# Altium schematic sheet Sheet2.SchDoc
size A0
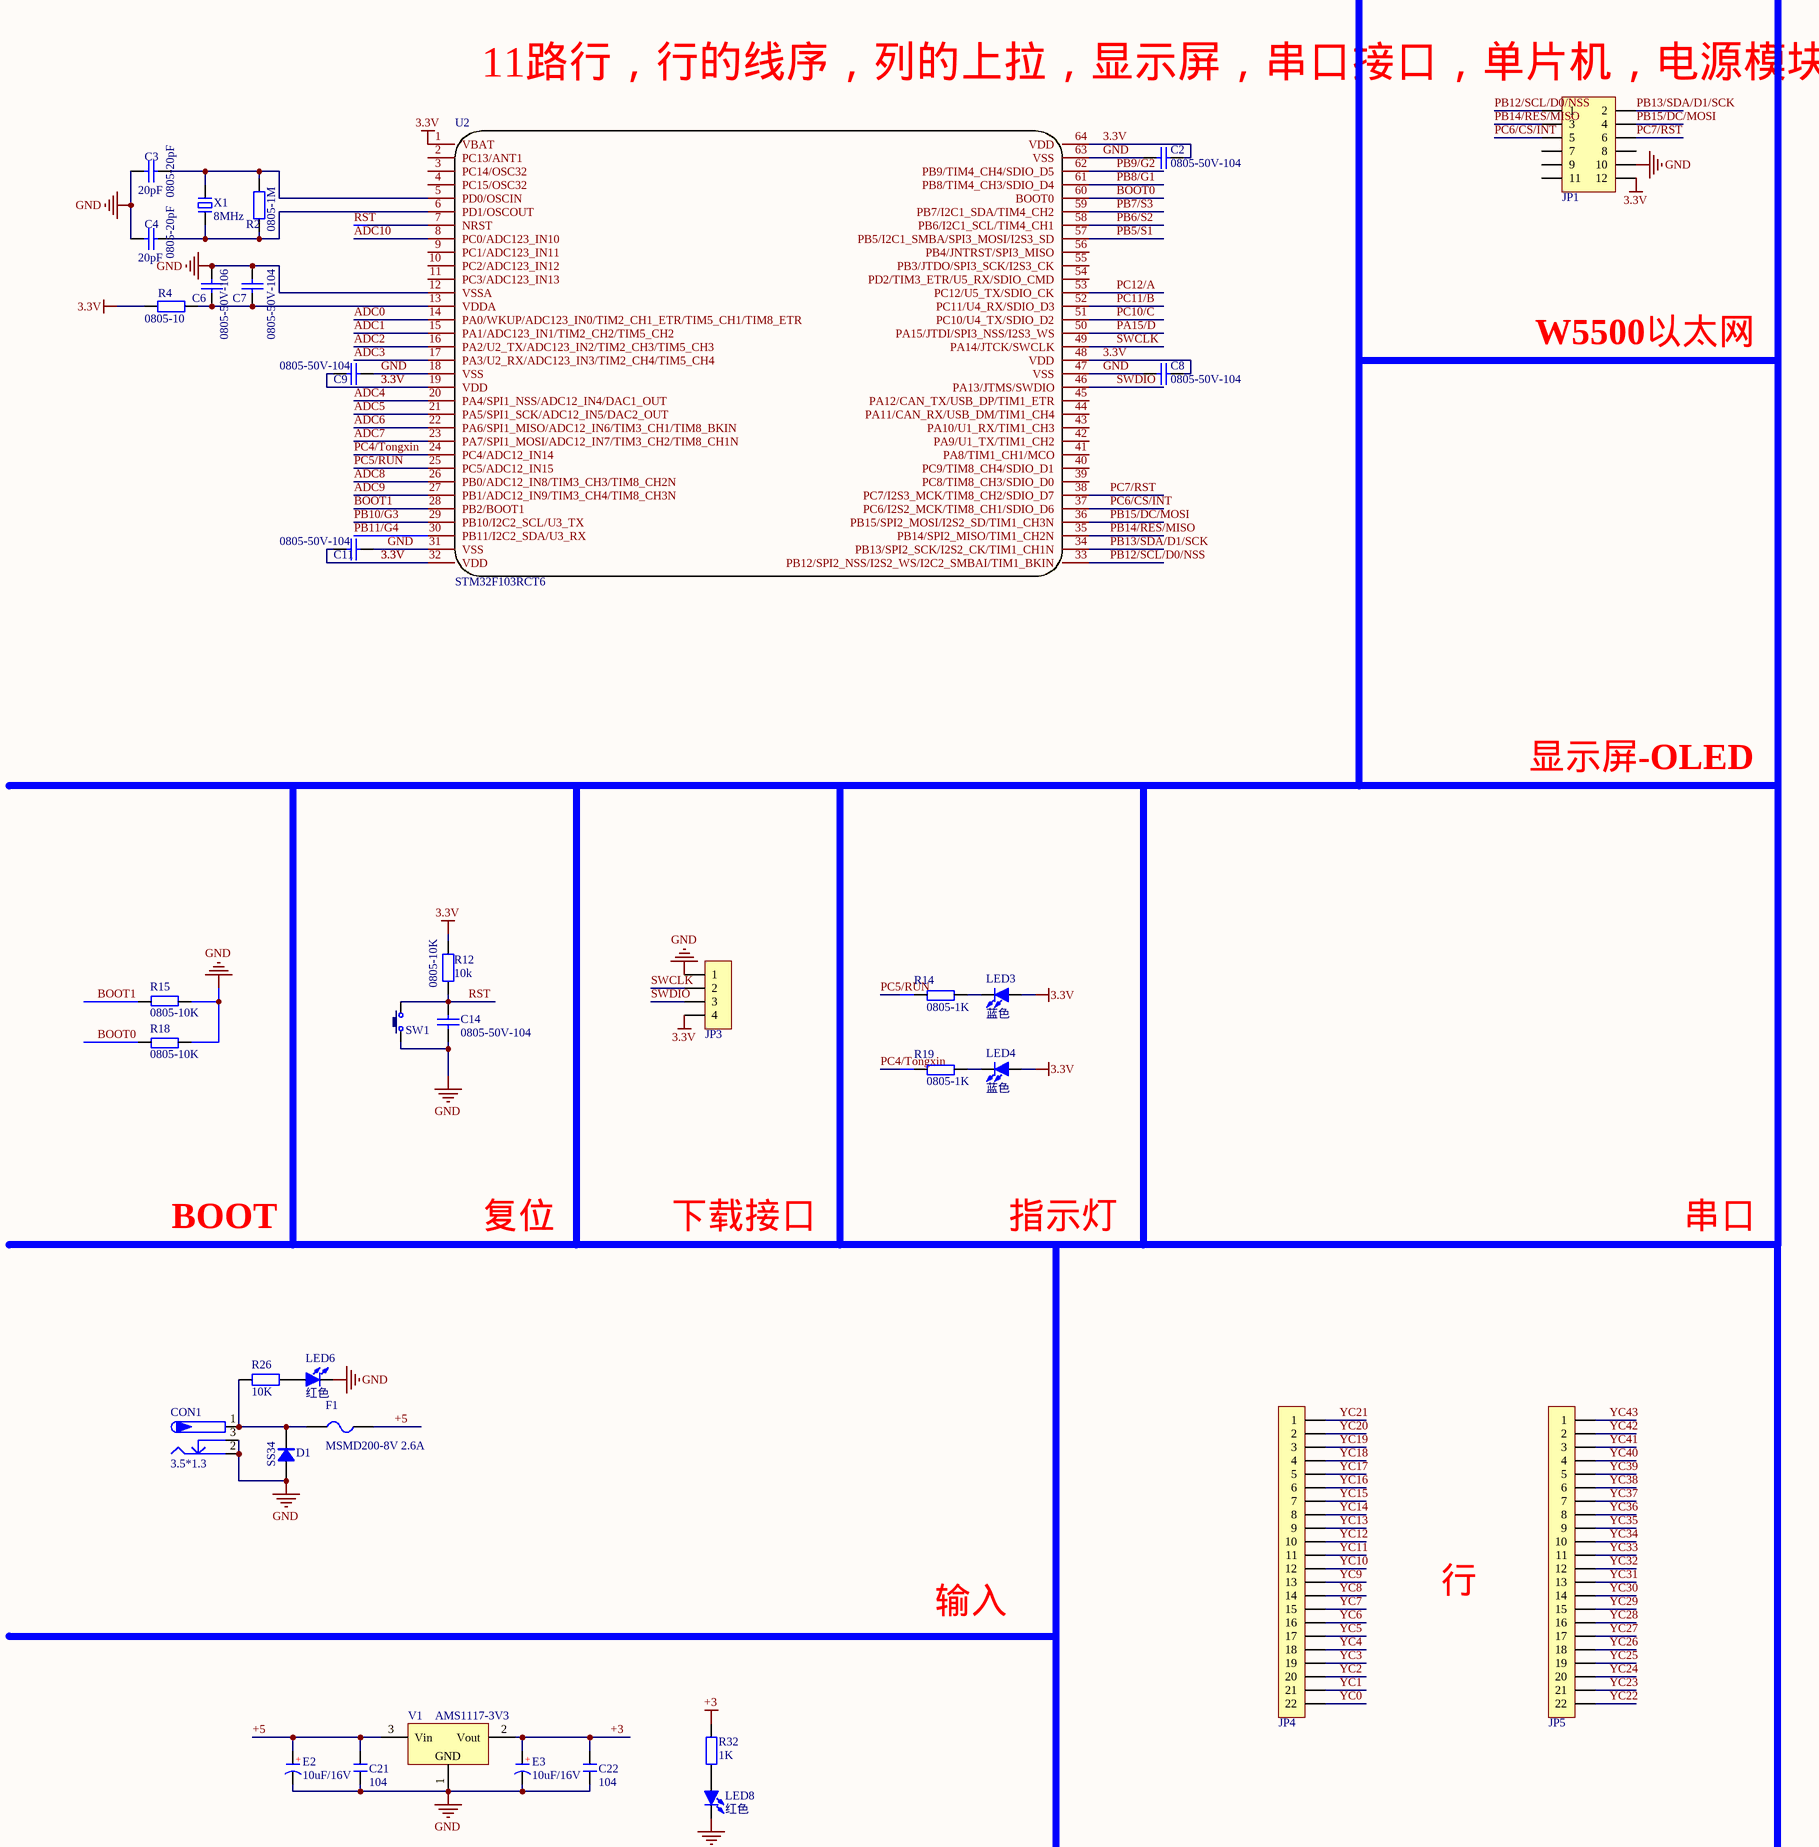
[diagram p0: Sheet2.SchDoc, top left]
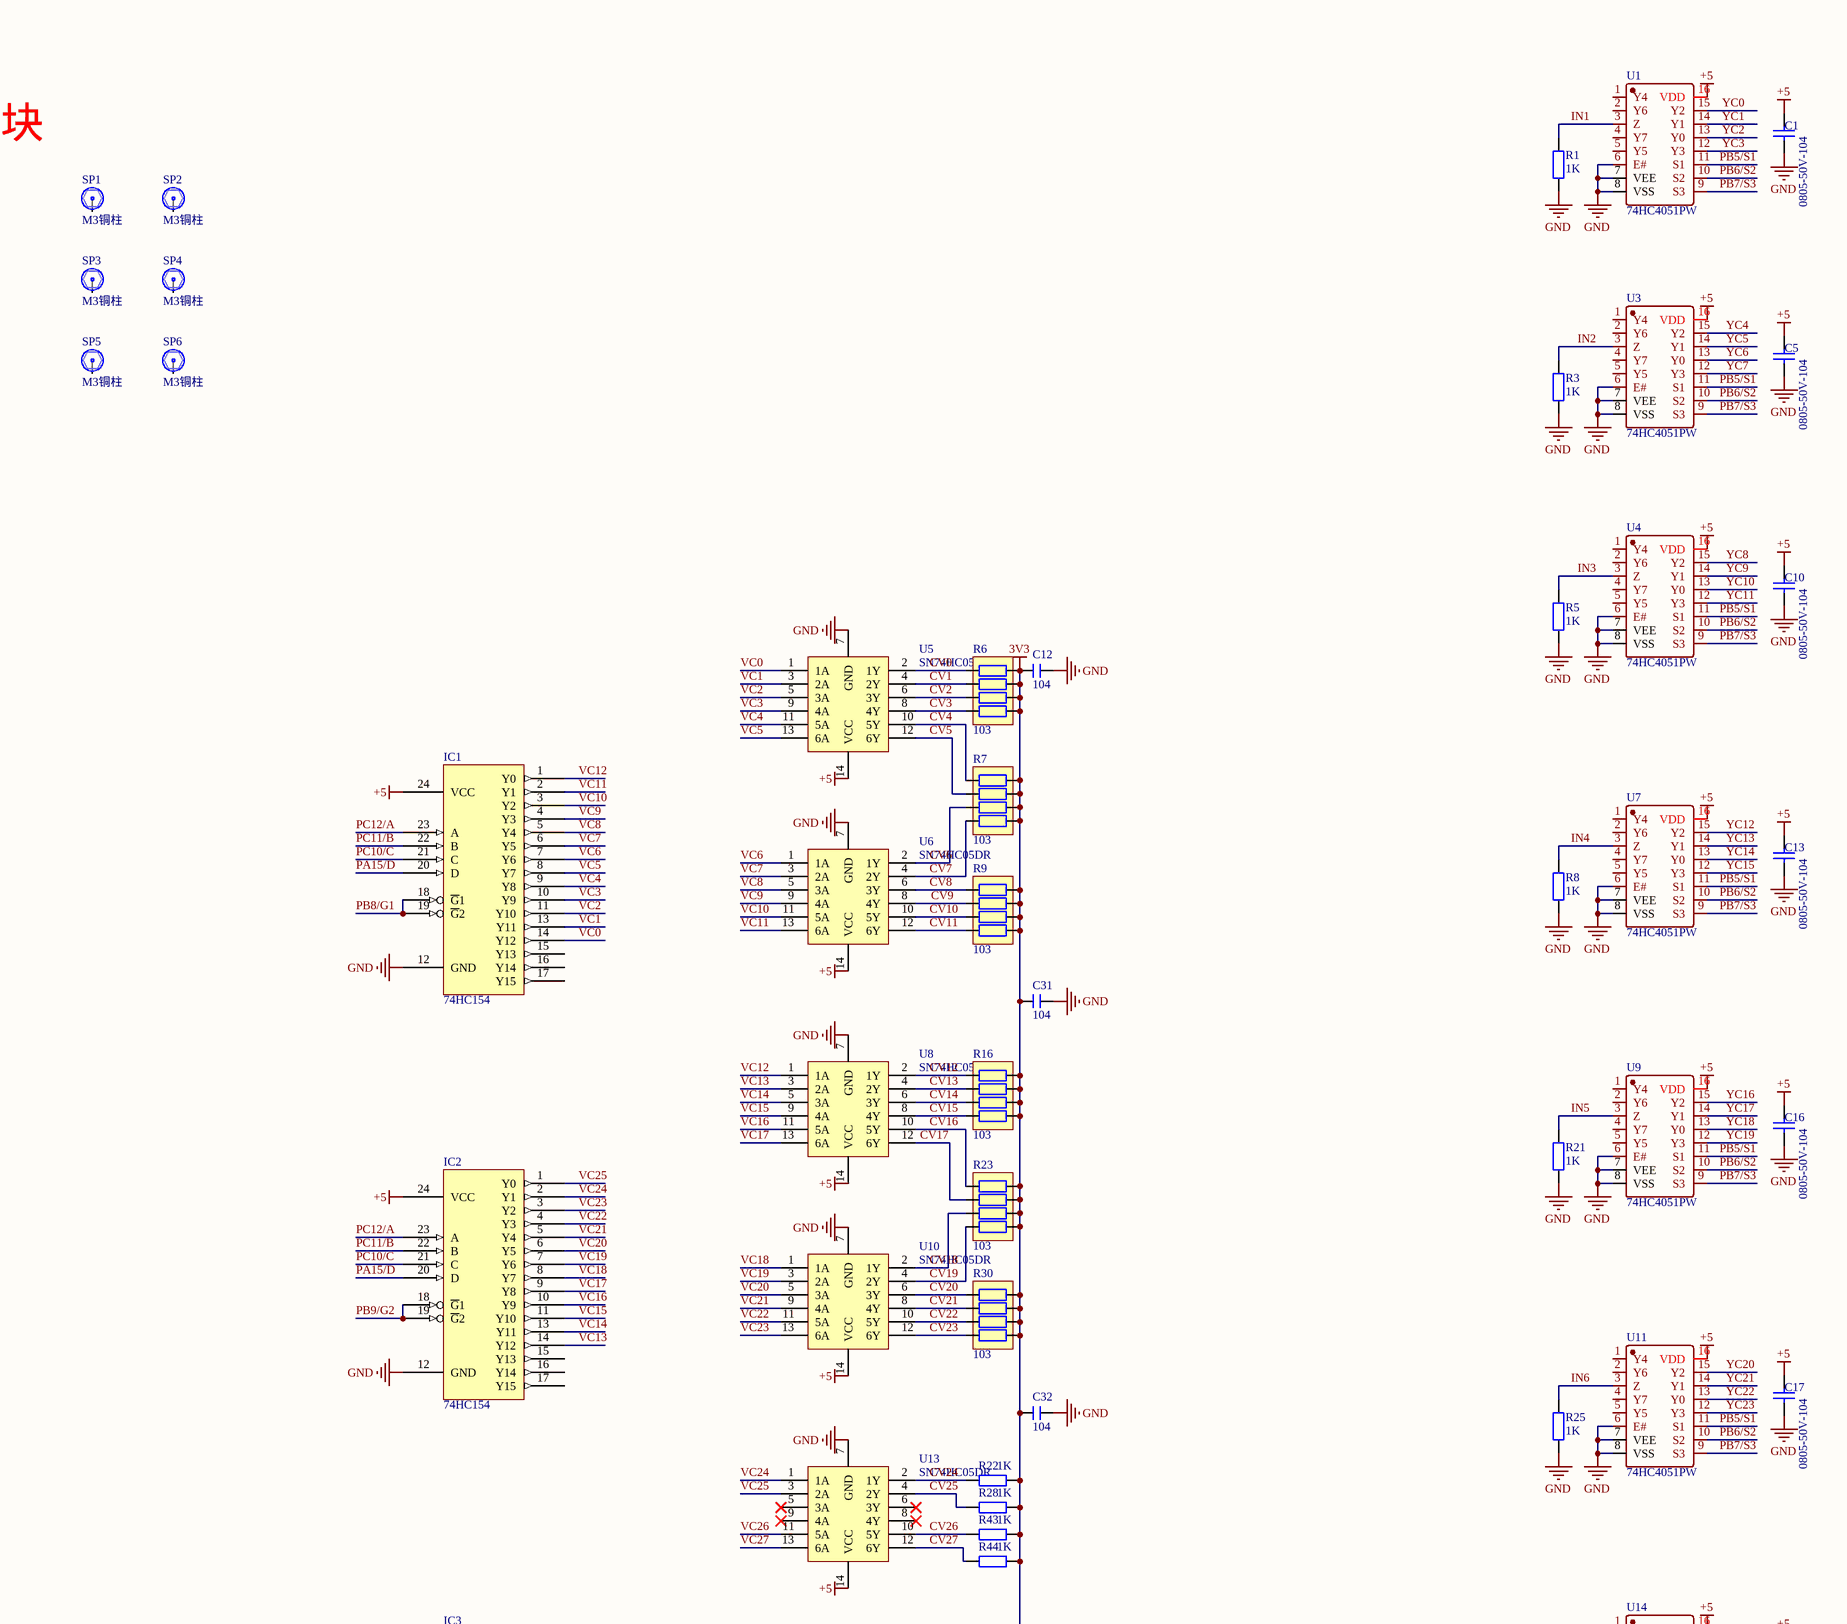
[diagram p1: Sheet2.SchDoc, top right]
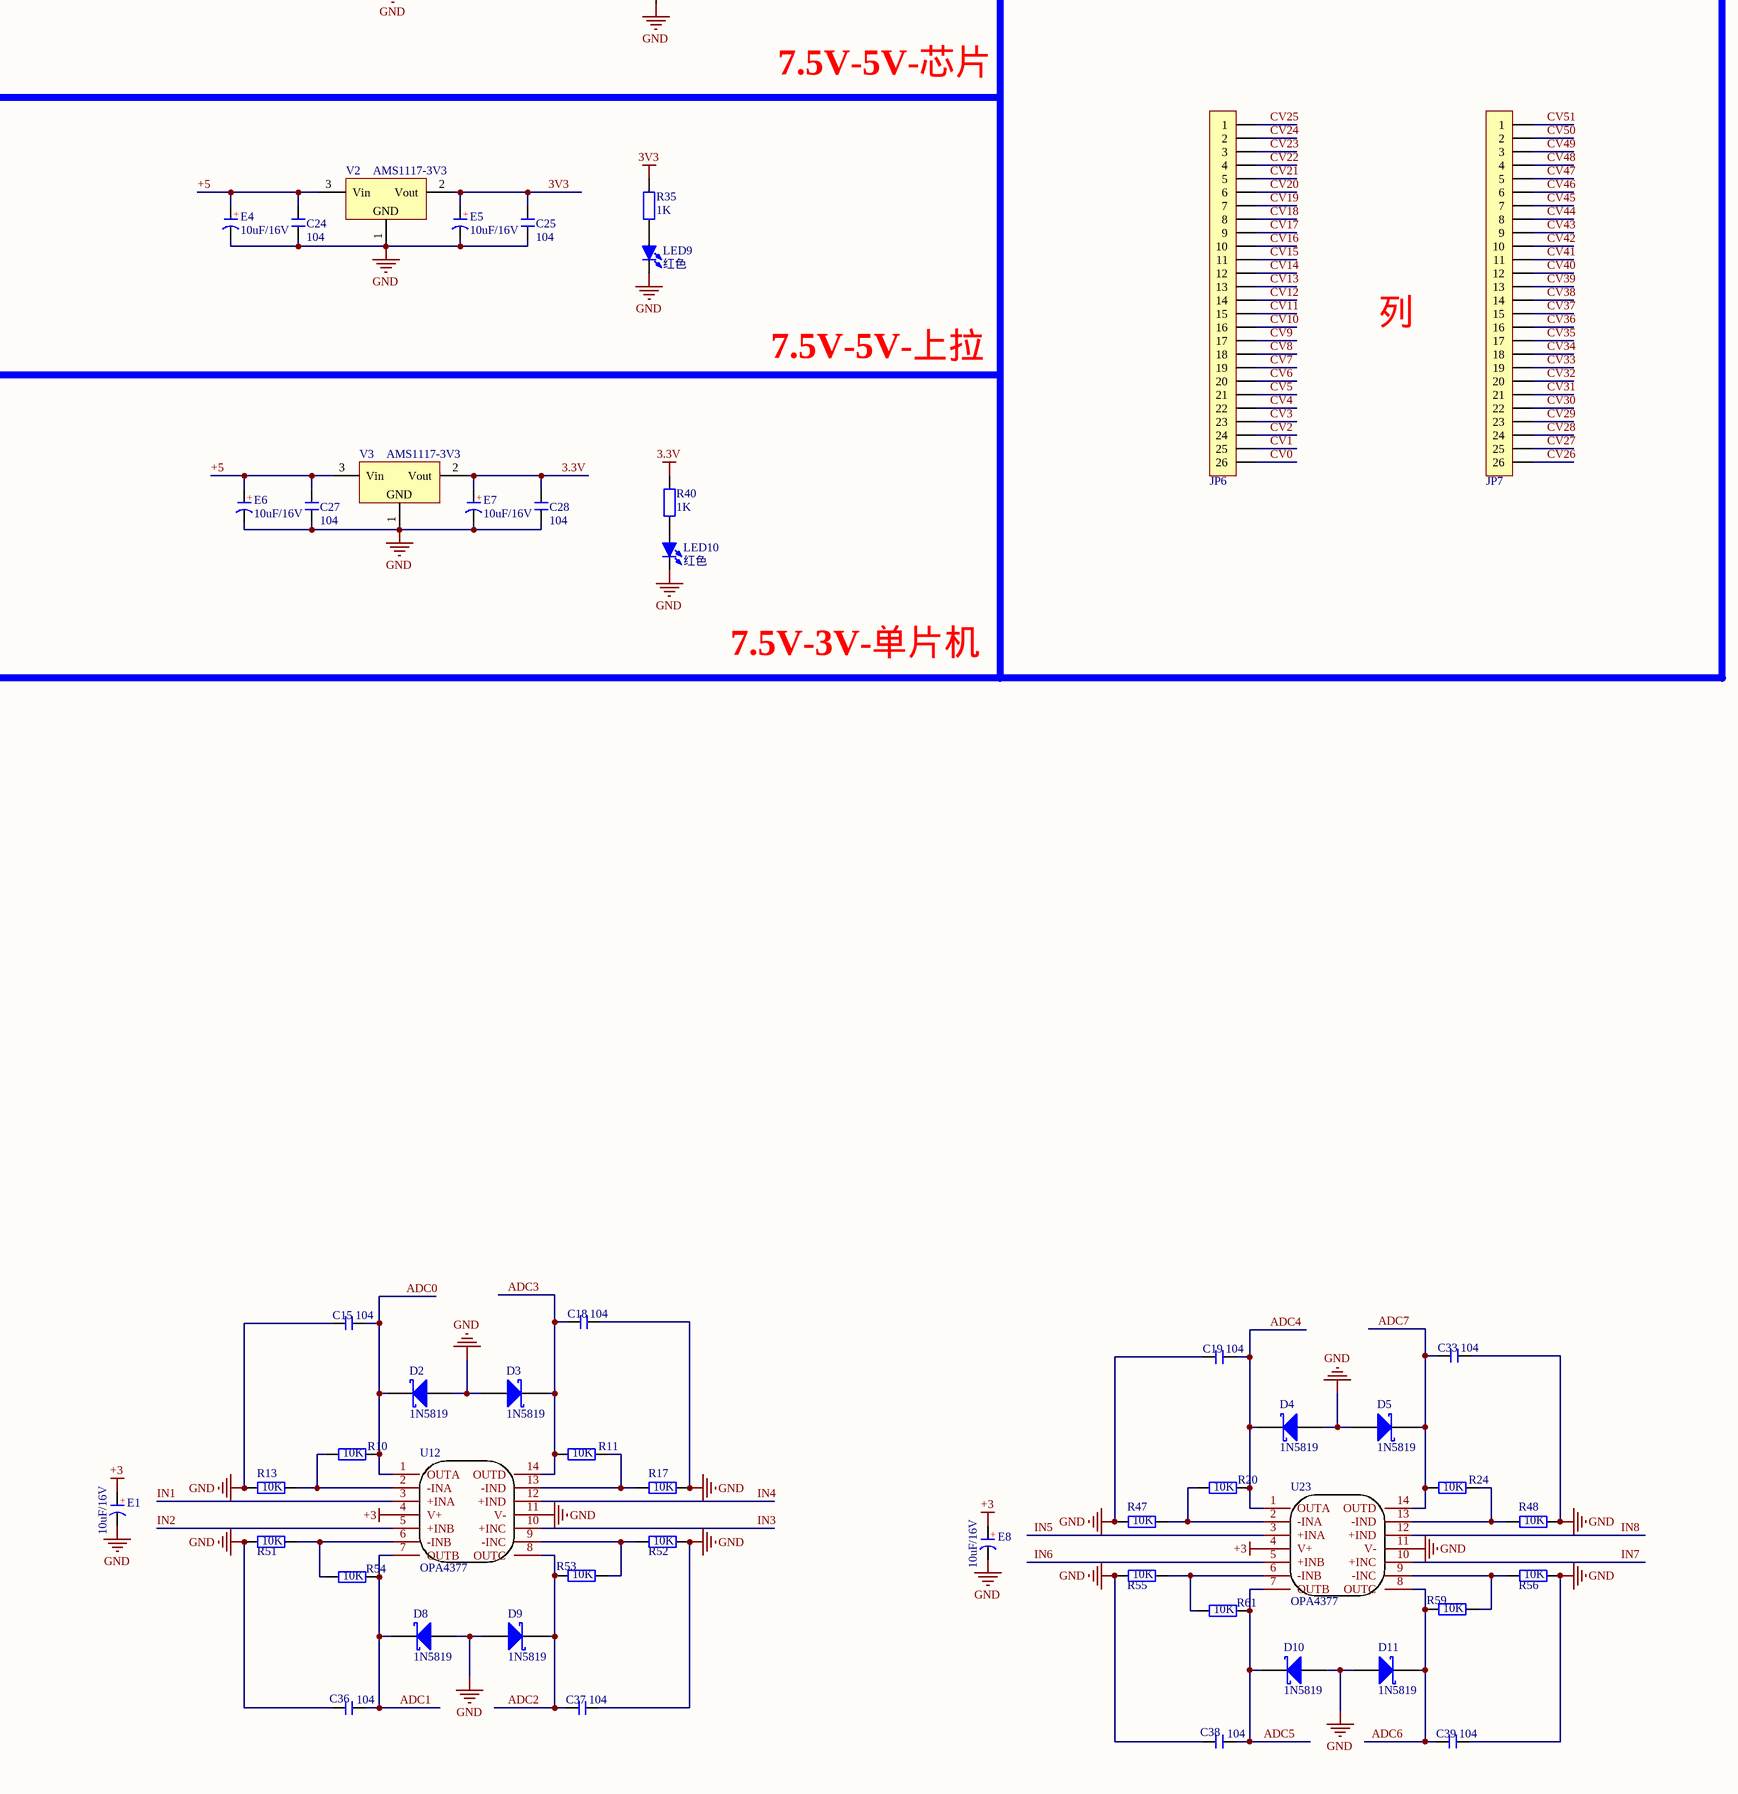
[diagram p2: Sheet2.SchDoc, bottom left]
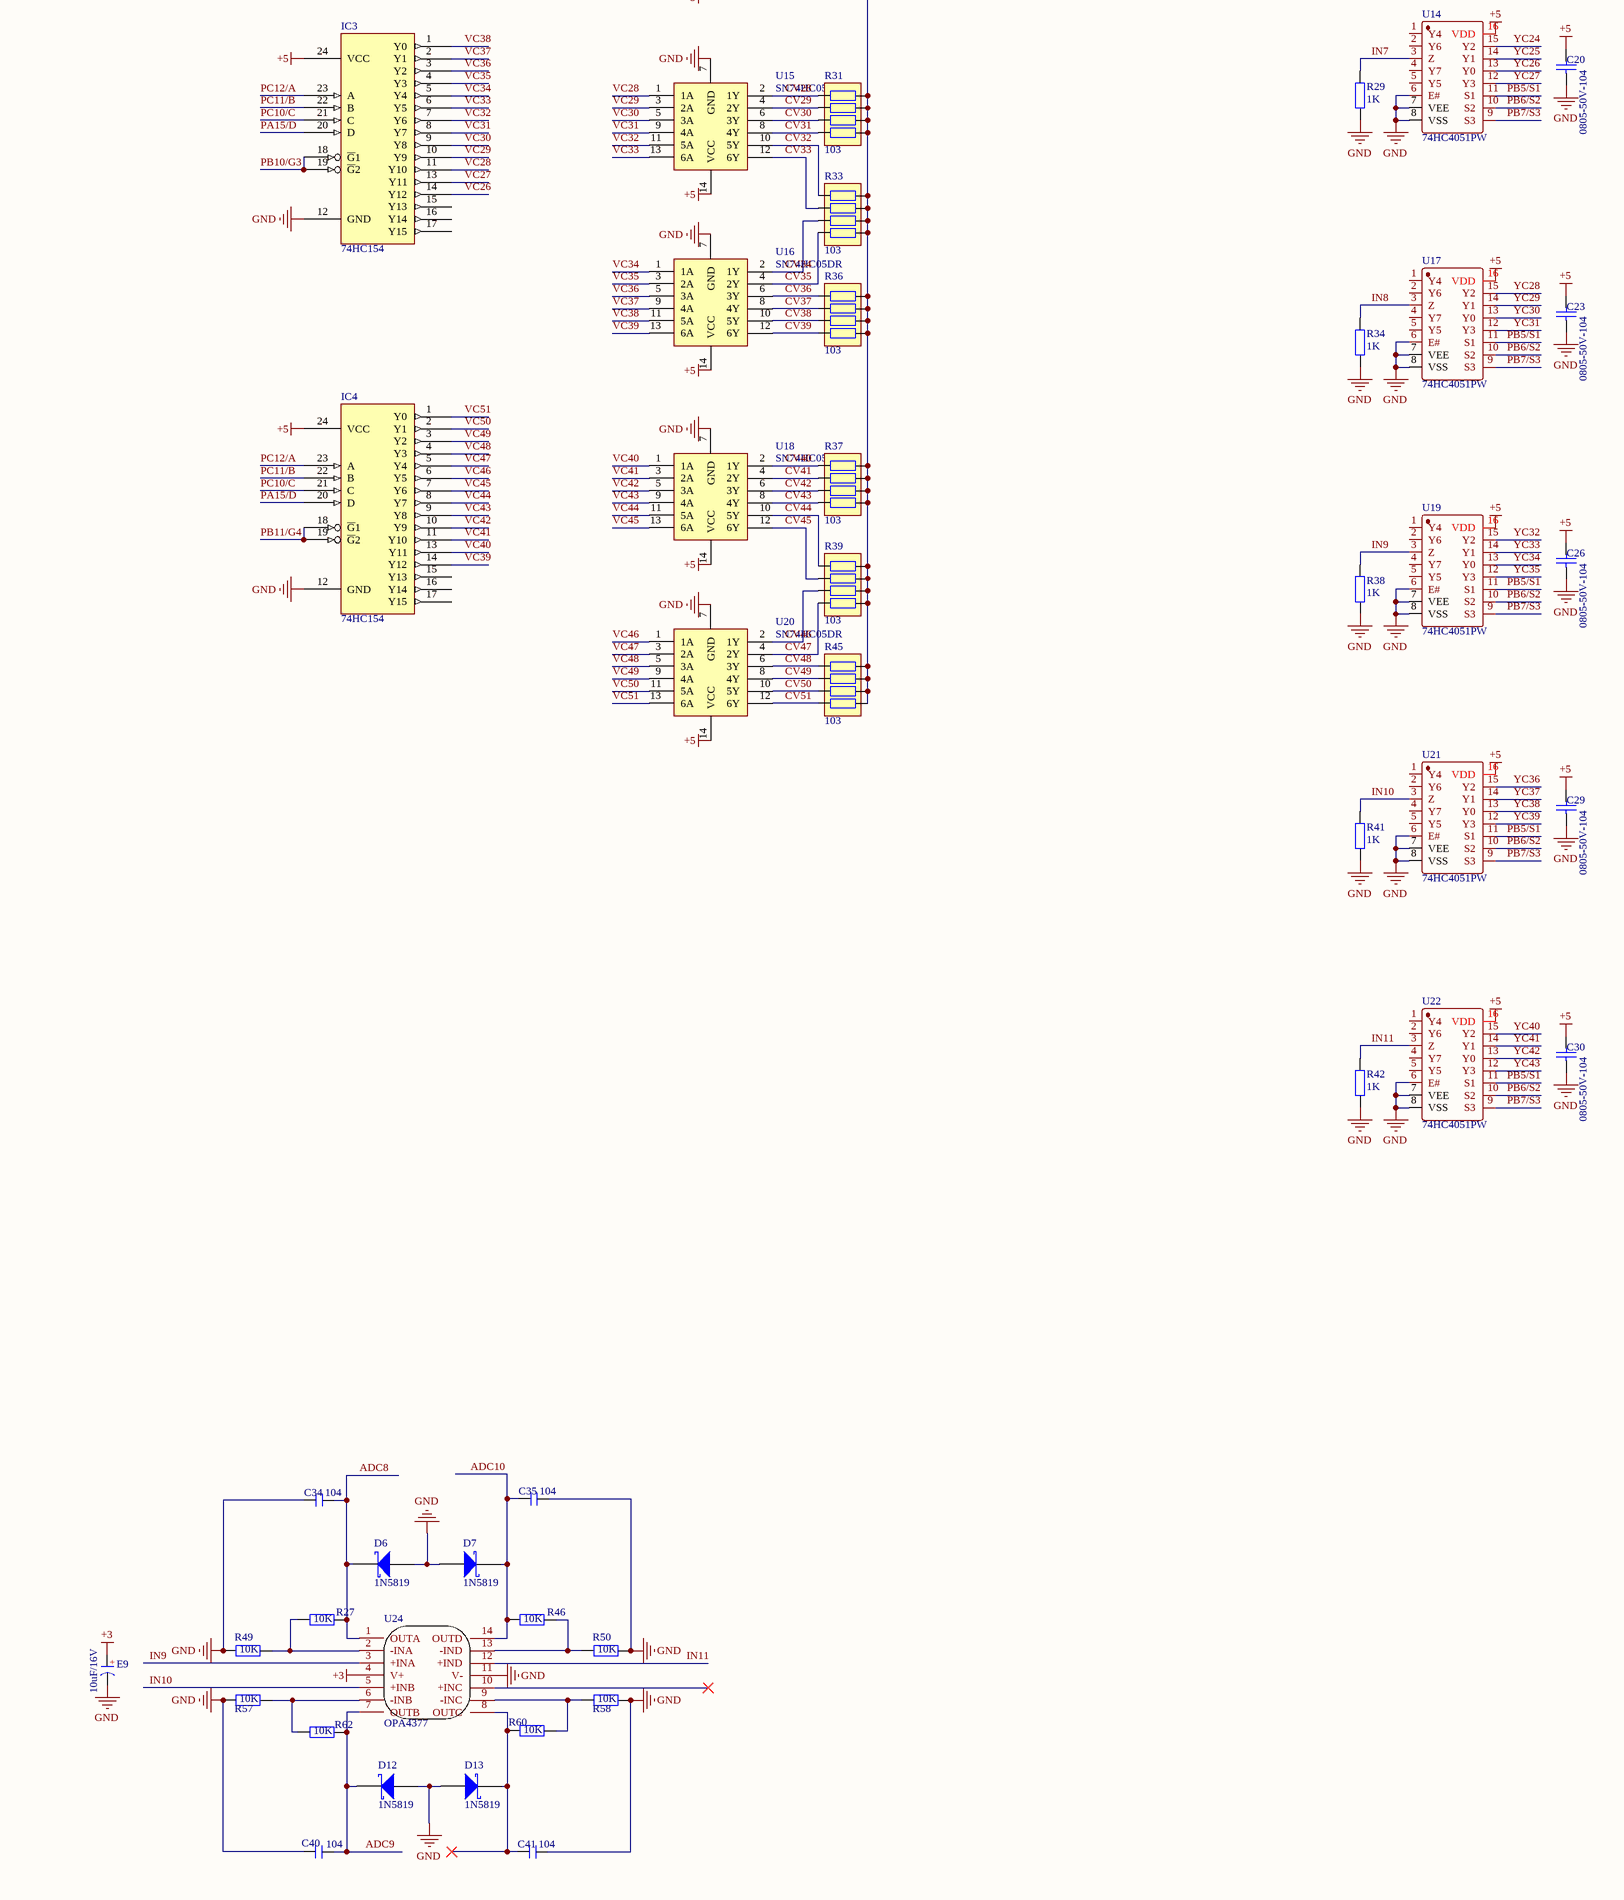
[diagram p3: Sheet2.SchDoc, bottom right]

## Parts
C1  0805-50V-104  [0805C]
C2  0805-50V-104  [0805C]
C3  0805-20pF  value 20pF  [0805C]
C4  0805-20pF  value 20pF  [0805C]
C5  0805-50V-104  [0805C]
C6  0805-50V-106  [0805C]
C7  0805-50V-104  [0805C]
C8  0805-50V-104  [0805C]
C9  0805-50V-104  [0805C]
C10  0805-50V-104  [0805C]
C11  0805-50V-104  [0805C]
C12  104  [C 0805_L]
C13  0805-50V-104  [0805C]
C14  0805-50V-104  [0805C]
C15  104  [C 0603_L]
C16  0805-50V-104  [0805C]
C17  0805-50V-104  [0805C]
C18  104  [C 0603_L]
C19  104  [C 0603_L]
C20  0805-50V-104  [0805C]
C21  104  [C 0805_L]
C22  104  [C 0805_L]
C23  0805-50V-104  [0805C]
C24  104  [C 0805_L]
C25  104  [C 0805_L]
C26  0805-50V-104  [0805C]
C27  104  [C 0805_L]
C28  104  [C 0805_L]
C29  0805-50V-104  [0805C]
C30  0805-50V-104  [0805C]
C31  104  [C 0805_L]
C32  104  [C 0805_L]
C33  104  [C 0603_L]
C34  104  [C 0603_L]
C35  104  [C 0603_L]
C36  104  [C 0603_L]
C37  104  [C 0603_L]
C38  104  [C 0603_L]
C39  104  [C 0603_L]
C40  104  [C 0603_L]
C41  104  [C 0603_L]
CON1  3.5*1.3  [DC-005]
D1  SS34  [SMA]
D2  1N5819  [SOD-123]
D3  1N5819  [SOD-123]
D4  1N5819  [SOD-123]
D5  1N5819  [SOD-123]
D6  1N5819  [SOD-123]
D7  1N5819  [SOD-123]
D8  1N5819  [SOD-123]
D9  1N5819  [SOD-123]
D10  1N5819  [SOD-123]
D11  1N5819  [SOD-123]
D12  1N5819  [SOD-123]
D13  1N5819  [SOD-123]
E1  10uF/16V  [CD A(3216)]
E2  10uF/16V  [CD A(3216)]
E3  10uF/16V  [CD A(3216)]
E4  10uF/16V  [CD A(3216)]
E5  10uF/16V  [CD A(3216)]
E6  10uF/16V  [CD A(3216)]
E7  10uF/16V  [CD A(3216)]
E8  10uF/16V  [CD A(3216)]
E9  10uF/16V  [CD A(3216)]
F1  MSMD200-8V 2.6A  [FU 1812]
IC1  74HC154  [SOP24_N]
IC2  74HC154  [SOP24_N]
IC3  74HC154  [SOP24_N]
IC4  74HC154  [SOP24_N]
JP1  Header 6X2  [HDR2.54-LI-2x6P]  (value not drawn)
JP3  HDR-1X4  [HDR2.54-WI-4P]  (value not drawn)
JP4  FPC1.0-22P  [FPC1.0-2H-WS-22P]  (value not drawn)
JP5  FPC1.0-22P  [FPC1.0-2H-WS-22P]  (value not drawn)
JP6  FPC1.0-26P  [FPC1.0-2H-WS-26P]  (value not drawn)
JP7  FPC1.0-26P  [FPC1.0-2H-WS-26P]  (value not drawn)
LED3  蓝色  [LED 0805B]
LED4  蓝色  [LED 0805B]
LED6  红色  [LED 0805R]
LED8  红色  [LED 0805R]
LED9  红色  [LED 0805R]
LED10  红色  [LED 0805R]
R1  1K  [R 0805_L]
R2  0805-1M  [0805R]
R3  1K  [R 0805_L]
R4  0805-10  [0805R]
R5  1K  [R 0805_L]
R6  103  [RCA-8P4R-0603]
R7  103  [RCA-8P4R-0603]
R8  1K  [R 0805_L]
R9  103  [RCA-8P4R-0603]
R10  10K  [R 0603_L]
R11  10K  [R 0603_L]
R12  0805-10K  value 10k  [0805R]
R13  10K  [R 0603_L]
R14  0805-1K  [0805R]
R15  0805-10K  [0805R]
R16  103  [RCA-8P4R-0603]
R17  10K  [R 0603_L]
R18  0805-10K  [0805R]
R19  0805-1K  [0805R]
R20  10K  [R 0603_L]
R21  1K  [R 0805_L]
R22  1K  [R 0805_L]
R23  103  [RCA-8P4R-0603]
R24  10K  [R 0603_L]
R25  1K  [R 0805_L]
R26  10K  [R 0805_L]
R27  10K  [R 0603_L]
R28  1K  [R 0805_L]
R29  1K  [R 0805_L]
R30  103  [RCA-8P4R-0603]
R31  103  [RCA-8P4R-0603]
R32  1K  [R 0805_L]
R33  103  [RCA-8P4R-0603]
R34  1K  [R 0805_L]
R35  1K  [R 0805_L]
R36  103  [RCA-8P4R-0603]
R37  103  [RCA-8P4R-0603]
R38  1K  [R 0805_L]
R39  103  [RCA-8P4R-0603]
R40  1K  [R 0805_L]
R41  1K  [R 0805_L]
R42  1K  [R 0805_L]
R43  1K  [R 0805_L]
R44  1K  [R 0805_L]
R45  103  [RCA-8P4R-0603]
R46  10K  [R 0603_L]
R47  10K  [R 0603_L]
R48  10K  [R 0603_L]
R49  10K  [R 0603_L]
R50  10K  [R 0603_L]
R51  10K  [R 0603_L]
R52  10K  [R 0603_L]
R53  10K  [R 0603_L]
R54  10K  [R 0603_L]
R55  10K  [R 0603_L]
R56  10K  [R 0603_L]
R57  10K  [R 0603_L]
R58  10K  [R 0603_L]
R59  10K  [R 0603_L]
R60  10K  [R 0603_L]
R61  10K  [R 0603_L]
R62  10K  [R 0603_L]
SP1  M3铜柱  [M3x20_L]
SP2  M3铜柱  [M3x20_L]
SP3  M3铜柱  [M3x20_L]
SP4  M3铜柱  [M3x20_L]
SP5  M3铜柱  [M3x20_L]
SP6  M3铜柱  [M3x20_L]
SW1  3x6x5  [TSW SMD-3*6*2.5]  (value not drawn)
U1  74HC4051PW  [TSSOP16_N]
U2  STM32F103RCT6  [LQFP64-10*10]
U3  74HC4051PW  [TSSOP16_N]
U4  74HC4051PW  [TSSOP16_N]
U5  SN74HC05DR  [SOP14]
U6  SN74HC05DR  [SOP14]
U7  74HC4051PW  [TSSOP16_N]
U8  SN74HC05DR  [SOP14]
U9  74HC4051PW  [TSSOP16_N]
U10  SN74HC05DR  [SOP14]
U11  74HC4051PW  [TSSOP16_N]
U12  OPA4377  [TSSOP14_L]
U13  SN74HC05DR  [SOP14]
U14  74HC4051PW  [TSSOP16_N]
U15  SN74HC05DR  [SOP14]
U16  SN74HC05DR  [SOP14]
U17  74HC4051PW  [TSSOP16_N]
U18  SN74HC05DR  [SOP14]
U19  74HC4051PW  [TSSOP16_N]
U20  SN74HC05DR  [SOP14]
U21  74HC4051PW  [TSSOP16_N]
U22  74HC4051PW  [TSSOP16_N]
U23  OPA4377  [TSSOP14_L]
U24  OPA4377  [TSSOP14_L]
V1  AMS1117-3V3  [SOT223_L]
V2  AMS1117-3V3  [SOT223_L]
V3  AMS1117-3V3  [SOT223_L]
X1  8MHz  [OSC 5032-2P]

## Nets
3.3V: C2.1 C8.1 C9.1 C11.1 C28.2 E7.1(A) JP1.12 JP3.4 LED3.1(A) LED4.1(A) R4.2 R12.2 R40.2 U2.1(VBAT) U2.19(VDD) U2.32(VDD) U2.48(VDD) U2.64(VDD) V3.2(Vout)
3V3: C12.1 C25.2 C31.1 C32.1 E5.1(A) R6.5 R6.6 R6.7 R6.8 R7.5 R7.6 R7.7 R7.8 R9.5 R9.6 R9.7 R9.8 R16.5 R16.6 R16.7 R16.8 R22.2 R23.5 R23.6 R23.7 R23.8 R28.2 R30.5 R30.6 R30.7 R30.8 R31.5 R31.6 R31.7 R31.8 R33.5 R33.6 R33.7 R33.8 R35.2 R36.5 R36.6 R36.7 R36.8 R37.5 R37.6 R37.7 R37.8 R39.5 R39.6 R39.7 R39.8 R43.2 R44.2 R45.5 R45.6 R45.7 R45.8 V2.2(Vout)
+3: C22.2 E1.1(A) E3.1(A) E8.1(A) E9.1(A) R32.2 U12.4(V+) U23.4(V+) U24.4(V+) V1.2(Vout)
+5: C1.2 C5.2 C10.2 C13.2 C16.2 C17.2 C20.2 C21.2 C23.2 C24.2 C26.2 C27.2 C29.2 C30.2 E2.1(A) E4.1(A) E6.1(A) F1.2 IC1.24(VCC) IC2.24(VCC) IC3.24(VCC) IC4.24(VCC) U1.16(VDD) U3.16(VDD) U4.16(VDD) U5.14(VCC) U6.14(VCC) U7.16(VDD) U8.14(VCC) U9.16(VDD) U10.14(VCC) U11.16(VDD) U13.14(VCC) U14.16(VDD) U15.14(VCC) U16.14(VCC) U17.16(VDD) U18.14(VCC) U19.16(VDD) U20.14(VCC) U21.16(VDD) U22.16(VDD) V1.3(Vin) V2.3(Vin) V3.3(Vin)
GND: C1.1 C2.2 C3.2 C4.2 C5.1 C6.1 C7.1 C8.2 C9.2 C10.1 C11.2 C12.2 C13.1 C14.1 C15.1 C16.1 C17.1 C18.2 C19.1 C20.1 C21.1 C22.1 C23.1 C24.1 C25.1 C26.1 C27.1 C28.1 C29.1 C30.1 C31.2 C32.2 C33.2 C34.1 C35.2 C36.2 C37.2 C38.2 C39.2 C40.2 C41.2 CON1.2 CON1.3 D1.1(A) D2.1(A) D3.1(A) D4.1(A) D5.1(A) D6.1(A) D7.1(A) D8.1(A) D9.1(A) D10.1(A) D11.1(A) D12.1(A) D13.1(A) E1.2(K) E2.2(K) E3.2(K) E4.2(K) E5.2(K) E6.2(K) E7.2(K) E8.2(K) E9.2(K) IC1.12(GND) IC2.12(GND) IC3.12(GND) IC4.12(GND) JP1.10 JP3.1 LED6.2(K) LED8.2(K) LED9.2(K) LED10.2(K) R1.1 R3.1 R5.1 R8.1 R13.2 R15.1 R17.1 R18.2 R21.1 R25.1 R29.1 R34.1 R38.1 R41.1 R42.1 R47.2 R48.1 R49.2 R50.1 R51.1 R52.2 R55.1 R56.2 R57.1 R58.2 SW1.1 U1.6(E#) U1.7(VEE) U1.8(VSS) U2.12(VSSA) U2.18(VSS) U2.31(VSS) U2.47(VSS) U2.63(VSS) U3.6(E#) U3.7(VEE) U3.8(VSS) U4.6(E#) U4.7(VEE) U4.8(VSS) U5.7(GND) U6.7(GND) U7.6(E#) U7.7(VEE) U7.8(VSS) U8.7(GND) U9.6(E#) U9.7(VEE) U9.8(VSS) U10.7(GND) U11.6(E#) U11.7(VEE) U11.8(VSS) U12.11(V-) U13.7(GND) U14.6(E#) U14.7(VEE) U14.8(VSS) U15.7(GND) U16.7(GND) U17.6(E#) U17.7(VEE) U17.8(VSS) U18.7(GND) U19.6(E#) U19.7(VEE) U19.8(VSS) U20.7(GND) U21.6(E#) U21.7(VEE) U21.8(VSS) U22.6(E#) U22.7(VEE) U22.8(VSS) U23.11(V-) U24.11(V-) V1.1(GND) V2.1(GND) V3.1(GND)
ADC0: C15.2 D2.2(K) R10.2 U2.14(PA0/WKUP/ADC123_IN0/TIM2_CH1_ETR/TIM5_CH1/TIM8_ETR) U12.1(OUTA)
ADC1: C36.1 D8.2(K) R54.2 U2.15(PA1/ADC123_IN1/TIM2_CH2/TIM5_CH2) U12.7(OUTB)
ADC2: C37.1 D9.2(K) R53.1 U2.16(PA2/U2_TX/ADC123_IN2/TIM2_CH3/TIM5_CH3) U12.8(OUTC)
ADC3: C18.1 D3.2(K) R11.1 U2.17(PA3/U2_RX/ADC123_IN3/TIM2_CH4/TIM5_CH4) U12.14(OUTD)
ADC4: C19.2 D4.2(K) R20.2 U2.20(PA4/SPI1_NSS/ADC12_IN4/DAC1_OUT) U23.1(OUTA)
ADC5: C38.1 D10.2(K) R61.2 U2.21(PA5/SPI1_SCK/ADC12_IN5/DAC2_OUT) U23.7(OUTB)
ADC6: C39.1 D11.2(K) R59.1 U2.22(PA6/SPI1_MISO/ADC12_IN6/TIM3_CH1/TIM8_BKIN) U23.8(OUTC)
ADC7: C33.1 D5.2(K) R24.1 U2.23(PA7/SPI1_MOSI/ADC12_IN7/TIM3_CH2/TIM8_CH1N) U23.14(OUTD)
ADC8: C34.2 D6.2(K) R27.2 U2.26(PB0/ADC12_IN8/TIM3_CH3/TIM8_CH2N) U24.1(OUTA)
ADC9: C40.1 D12.2(K) R62.2 U2.27(PB1/ADC12_IN9/TIM3_CH4/TIM8_CH3N) U24.7(OUTB)
ADC10: C35.1 D7.2(K) R46.1 U2.8(PC0/ADC123_IN10) U24.14(OUTD)
BOOT0: R18.1 U2.60(BOOT0)
BOOT1: R15.2 U2.28(PB2/BOOT1)
CV0: JP6.26 R6.4 U5.2(1Y)
CV1: JP6.25 R6.3 U5.4(2Y)
CV2: JP6.24 R6.2 U5.6(3Y)
CV3: JP6.23 R6.1 U5.8(4Y)
CV4: JP6.22 R7.4 U5.10(5Y)
CV5: JP6.21 R7.3 U5.12(6Y)
CV6: JP6.20 R7.2 U6.2(1Y)
CV7: JP6.19 R7.1 U6.4(2Y)
CV8: JP6.18 R9.4 U6.6(3Y)
CV9: JP6.17 R9.3 U6.8(4Y)
CV10: JP6.16 R9.2 U6.10(5Y)
CV11: JP6.15 R9.1 U6.12(6Y)
CV12: JP6.14 R16.4 U8.2(1Y)
CV13: JP6.13 R16.3 U8.4(2Y)
CV14: JP6.12 R16.2 U8.6(3Y)
CV15: JP6.11 R16.1 U8.8(4Y)
CV16: JP6.10 R23.4 U8.10(5Y)
CV17: JP6.9 R23.3 U8.12(6Y)
CV18: JP6.8 R23.2 U10.2(1Y)
CV19: JP6.7 R23.1 U10.4(2Y)
CV20: JP6.6 R30.4 U10.6(3Y)
CV21: JP6.5 R30.3 U10.8(4Y)
CV22: JP6.4 R30.2 U10.10(5Y)
CV23: JP6.3 R30.1 U10.12(6Y)
CV24: JP6.2 R22.1 U13.2(1Y)
CV25: JP6.1 R28.1 U13.4(2Y)
CV26: JP7.26 R43.1 U13.10(5Y)
CV27: JP7.25 R44.1 U13.12(6Y)
CV28: JP7.24 R31.4 U15.2(1Y)
CV29: JP7.23 R31.3 U15.4(2Y)
CV30: JP7.22 R31.2 U15.6(3Y)
CV31: JP7.21 R31.1 U15.8(4Y)
CV32: JP7.20 R33.4 U15.10(5Y)
CV33: JP7.19 R33.3 U15.12(6Y)
CV34: JP7.18 R33.2 U16.2(1Y)
CV35: JP7.17 R33.1 U16.4(2Y)
CV36: JP7.16 R36.4 U16.6(3Y)
CV37: JP7.15 R36.3 U16.8(4Y)
CV38: JP7.14 R36.2 U16.10(5Y)
CV39: JP7.13 R36.1 U16.12(6Y)
CV40: JP7.12 R37.4 U18.2(1Y)
CV41: JP7.11 R37.3 U18.4(2Y)
CV42: JP7.10 R37.2 U18.6(3Y)
CV43: JP7.9 R37.1 U18.8(4Y)
CV44: JP7.8 R39.4 U18.10(5Y)
CV45: JP7.7 R39.3 U18.12(6Y)
CV46: JP7.6 R39.2 U20.2(1Y)
CV47: JP7.5 R39.1 U20.4(2Y)
CV48: JP7.4 R45.4 U20.6(3Y)
CV49: JP7.3 R45.3 U20.8(4Y)
CV50: JP7.2 R45.2 U20.10(5Y)
CV51: JP7.1 R45.1 U20.12(6Y)
IN1: R1.2 U1.3(Z) U12.3(+INA)
IN2: R3.2 U3.3(Z) U12.5(+INB)
IN3: R5.2 U4.3(Z) U12.10(+INC)
IN4: R8.2 U7.3(Z) U12.12(+IND)
IN5: R21.2 U9.3(Z) U23.3(+INA)
IN6: R25.2 U11.3(Z) U23.5(+INB)
IN7: R29.2 U14.3(Z) U23.10(+INC)
IN8: R34.2 U17.3(Z) U23.12(+IND)
IN9: R38.2 U19.3(Z) U24.3(+INA)
IN10: R41.2 U21.3(Z) U24.5(+INB)
IN11: R42.2 U22.3(Z) U24.12(+IND)
PA15/D: IC1.20(D) IC2.20(D) IC3.20(D) IC4.20(D) U2.50(PA15/JTDI/SPI3_NSS/I2S3_WS)
PB5/S1: U1.11(S1) U2.57(PB5/I2C1_SMBA/SPI3_MOSI/I2S3_SD) U3.11(S1) U4.11(S1) U7.11(S1) U9.11(S1) U11.11(S1) U14.11(S1) U17.11(S1) U19.11(S1) U21.11(S1) U22.11(S1)
PB6/S2: U1.10(S2) U2.58(PB6/I2C1_SCL/TIM4_CH1) U3.10(S2) U4.10(S2) U7.10(S2) U9.10(S2) U11.10(S2) U14.10(S2) U17.10(S2) U19.10(S2) U21.10(S2) U22.10(S2)
PB7/S3: U1.9(S3) U2.59(PB7/I2C1_SDA/TIM4_CH2) U3.9(S3) U4.9(S3) U7.9(S3) U9.9(S3) U11.9(S3) U14.9(S3) U17.9(S3) U19.9(S3) U21.9(S3) U22.9(S3)
PB8/G1: IC1.18(~{G}1) IC1.19(~{G}2) U2.61(PB8/TIM4_CH3/SDIO_D4)
PB9/G2: IC2.18(~{G}1) IC2.19(~{G}2) U2.62(PB9/TIM4_CH4/SDIO_D5)
PB10/G3: IC3.18(~{G}1) IC3.19(~{G}2) U2.29(PB10/I2C2_SCL/U3_TX)
PB11/G4: IC4.18(~{G}1) IC4.19(~{G}2) U2.30(PB11/I2C2_SDA/U3_RX)
PB12/SCL/D0/NSS: JP1.1 U2.33(PB12/SPI2_NSS/I2S2_WS/I2C2_SMBAI/TIM1_BKIN)
PB13/SDA/D1/SCK: JP1.2 U2.34(PB13/SPI2_SCK/I2S2_CK/TIM1_CH1N)
PB14/RES/MISO: JP1.3 U2.35(PB14/SPI2_MISO/TIM1_CH2N)
PB15/DC/MOSI: JP1.4 U2.36(PB15/SPI2_MOSI/I2S2_SD/TIM1_CH3N)
PC4/Tongxin: R19.1 U2.24(PC4/ADC12_IN14)
PC5/RUN: R14.1 U2.25(PC5/ADC12_IN15)
PC6/CS/INT: JP1.5 U2.37(PC6/I2S2_MCK/TIM8_CH1/SDIO_D6)
PC7/RST: JP1.6 U2.38(PC7/I2S3_MCK/TIM8_CH2/SDIO_D7)
PC10/C: IC1.21(C) IC2.21(C) IC3.21(C) IC4.21(C) U2.51(PC10/U4_TX/SDIO_D2)
PC11/B: IC1.22(B) IC2.22(B) IC3.22(B) IC4.22(B) U2.52(PC11/U4_RX/SDIO_D3)
PC12/A: IC1.23(A) IC2.23(A) IC3.23(A) IC4.23(A) U2.53(PC12/U5_TX/SDIO_CK)
RST: C14.2 R12.1 SW1.2 U2.7(NRST)
SWCLK: JP3.2 U2.49(PA14/JTCK/SWCLK)
SWDIO: JP3.3 U2.46(PA13/JTMS/SWDIO)
VC0: IC1.14(Y12) U5.1(1A)
VC1: IC1.13(Y11) U5.3(2A)
VC2: IC1.11(Y10) U5.5(3A)
VC3: IC1.10(Y9) U5.9(4A)
VC4: IC1.9(Y8) U5.11(5A)
VC5: IC1.8(Y7) U5.13(6A)
VC6: IC1.7(Y6) U6.1(1A)
VC7: IC1.6(Y5) U6.3(2A)
VC8: IC1.5(Y4) U6.5(3A)
VC9: IC1.4(Y3) U6.9(4A)
VC10: IC1.3(Y2) U6.11(5A)
VC11: IC1.2(Y1) U6.13(6A)
VC12: IC1.1(Y0) U8.1(1A)
VC13: IC2.14(Y12) U8.3(2A)
VC14: IC2.13(Y11) U8.5(3A)
VC15: IC2.11(Y10) U8.9(4A)
VC16: IC2.10(Y9) U8.11(5A)
VC17: IC2.9(Y8) U8.13(6A)
VC18: IC2.8(Y7) U10.1(1A)
VC19: IC2.7(Y6) U10.3(2A)
VC20: IC2.6(Y5) U10.5(3A)
VC21: IC2.5(Y4) U10.9(4A)
VC22: IC2.4(Y3) U10.11(5A)
VC23: IC2.3(Y2) U10.13(6A)
VC24: IC2.2(Y1) U13.1(1A)
VC25: IC2.1(Y0) U13.3(2A)
VC26: IC3.14(Y12) U13.11(5A)
VC27: IC3.13(Y11) U13.13(6A)
VC28: IC3.11(Y10) U15.1(1A)
VC29: IC3.10(Y9) U15.3(2A)
VC30: IC3.9(Y8) U15.5(3A)
VC31: IC3.8(Y7) U15.9(4A)
VC32: IC3.7(Y6) U15.11(5A)
VC33: IC3.6(Y5) U15.13(6A)
VC34: IC3.5(Y4) U16.1(1A)
VC35: IC3.4(Y3) U16.3(2A)
VC36: IC3.3(Y2) U16.5(3A)
VC37: IC3.2(Y1) U16.9(4A)
VC38: IC3.1(Y0) U16.11(5A)
VC39: IC4.14(Y12) U16.13(6A)
VC40: IC4.13(Y11) U18.1(1A)
VC41: IC4.11(Y10) U18.3(2A)
VC42: IC4.10(Y9) U18.5(3A)
VC43: IC4.9(Y8) U18.9(4A)
VC44: IC4.8(Y7) U18.11(5A)
VC45: IC4.7(Y6) U18.13(6A)
VC46: IC4.6(Y5) U20.1(1A)
VC47: IC4.5(Y4) U20.3(2A)
VC48: IC4.4(Y3) U20.5(3A)
VC49: IC4.3(Y2) U20.9(4A)
VC50: IC4.2(Y1) U20.11(5A)
VC51: IC4.1(Y0) U20.13(6A)
YC0: JP4.22 U1.15(Y2)
YC1: JP4.21 U1.14(Y1)
YC2: JP4.20 U1.13(Y0)
YC3: JP4.19 U1.12(Y3)
YC4: JP4.18 U3.15(Y2)
YC5: JP4.17 U3.14(Y1)
YC6: JP4.16 U3.13(Y0)
YC7: JP4.15 U3.12(Y3)
YC8: JP4.14 U4.15(Y2)
YC9: JP4.13 U4.14(Y1)
YC10: JP4.12 U4.13(Y0)
YC11: JP4.11 U4.12(Y3)
YC12: JP4.10 U7.15(Y2)
YC13: JP4.9 U7.14(Y1)
YC14: JP4.8 U7.13(Y0)
YC15: JP4.7 U7.12(Y3)
YC16: JP4.6 U9.15(Y2)
YC17: JP4.5 U9.14(Y1)
YC18: JP4.4 U9.13(Y0)
YC19: JP4.3 U9.12(Y3)
YC20: JP4.2 U11.15(Y2)
YC21: JP4.1 U11.14(Y1)
YC22: JP5.22 U11.13(Y0)
YC23: JP5.21 U11.12(Y3)
YC24: JP5.20 U14.15(Y2)
YC25: JP5.19 U14.14(Y1)
YC26: JP5.18 U14.13(Y0)
YC27: JP5.17 U14.12(Y3)
YC28: JP5.16 U17.15(Y2)
YC29: JP5.15 U17.14(Y1)
YC30: JP5.14 U17.13(Y0)
YC31: JP5.13 U17.12(Y3)
YC32: JP5.12 U19.15(Y2)
YC33: JP5.11 U19.14(Y1)
YC34: JP5.10 U19.13(Y0)
YC35: JP5.9 U19.12(Y3)
YC36: JP5.8 U21.15(Y2)
YC37: JP5.7 U21.14(Y1)
YC38: JP5.6 U21.13(Y0)
YC39: JP5.5 U21.12(Y3)
YC40: JP5.4 U22.15(Y2)
YC41: JP5.3 U22.14(Y1)
YC42: JP5.2 U22.13(Y0)
YC43: JP5.1 U22.12(Y3)
NetC3_1: C3.1 R2.2 U2.5(PD0/OSCIN) X1.2
NetC4_1: C4.1 R2.1 U2.6(PD1/OSCOUT) X1.1
NetC6_2: C6.2 C7.2 R4.1 U2.13(VDDA)
NetC41_1: C41.1 D13.2(K) R60.1 U24.8(OUTC)
NetCON1_1: CON1.1 D1.2(K) F1.1 R26.1
NetLED3_2: LED3.2(K) R14.2
NetLED4_2: LED4.2(K) R19.2
NetLED6_1: LED6.1(A) R26.2
NetLED8_1: LED8.1(A) R32.1
NetLED9_1: LED9.1(A) R35.1
NetLED10_1: LED10.1(A) R40.1
NetR10_1: R10.1 R13.1 U12.2(-INA)
NetR11_2: R11.2 R17.2 U12.13(-IND)
NetR20_1: R20.1 R47.1 U23.2(-INA)
NetR24_2: R24.2 R48.2 U23.13(-IND)
NetR27_1: R27.1 R49.1 U24.2(-INA)
NetR46_2: R46.2 R50.2 U24.13(-IND)
NetR51_2: R51.2 R54.1 U12.6(-INB)
NetR52_1: R52.1 R53.2 U12.9(-INC)
NetR55_2: R55.2 R61.1 U23.6(-INB)
NetR56_1: R56.1 R59.2 U23.9(-INC)
NetR57_2: R57.2 R62.1 U24.6(-INB)
NetR58_1: R58.1 R60.2 U24.9(-INC)

Not connected (* = marked no-connect by the designer): IC1 15(Y13) 16(Y14) 17(Y15); IC2 15(Y13) 16(Y14) 17(Y15); IC3 15(Y13) 16(Y14) 17(Y15); IC4 15(Y13) 16(Y14) 17(Y15); JP1 7 8 9 11; SP1 1; SP2 1; SP3 1; SP4 1; SP5 1; SP6 1; U1 1(Y4) 2(Y6) 4(Y7) 5(Y5); U2 2(PC13/ANT1) 3(PC14/OSC32) 4(PC15/OSC32) 9(PC1/ADC123_IN11) 10(PC2/ADC123_IN12) 11(PC3/ADC123_IN13) 39(PC8/TIM8_CH3/SDIO_D0) 40(PC9/TIM8_CH4/SDIO_D1) 41(PA8/TIM1_CH1/MCO) 42(PA9/U1_TX/TIM1_CH2) 43(PA10/U1_RX/TIM1_CH3) 44(PA11/CAN_RX/USB_DM/TIM1_CH4) 45(PA12/CAN_TX/USB_DP/TIM1_ETR) 54(PD2/TIM3_ETR/U5_RX/SDIO_CMD) 55(PB3/JTDO/SPI3_SCK/I2S3_CK) 56(PB4/JNTRST/SPI3_MISO); U3 1(Y4) 2(Y6) 4(Y7) 5(Y5); U4 1(Y4) 2(Y6) 4(Y7) 5(Y5); U7 1(Y4) 2(Y6) 4(Y7) 5(Y5); U9 1(Y4) 2(Y6) 4(Y7) 5(Y5); U11 1(Y4) 2(Y6) 4(Y7) 5(Y5); U13 5(3A)* 6(3Y)* 8(4Y)* 9(4A)*; U14 1(Y4) 2(Y6) 4(Y7) 5(Y5); U17 1(Y4) 2(Y6) 4(Y7) 5(Y5); U19 1(Y4) 2(Y6) 4(Y7) 5(Y5); U21 1(Y4) 2(Y6) 4(Y7) 5(Y5); U22 1(Y4) 2(Y6) 4(Y7) 5(Y5); U24 10(+INC)*

## Notes on the sheet
- 11路行，行的线序，列的上拉，显示屏，串口接口，单片机，电源模块
- W5500以太网
- (near C9) 3.3V
- (near C11) 3.3V
- 显示屏-OLED
- BOOT
- 复位
- 下载接口
- 指示灯
- 串口
- 输入
- 行
- 7.5V-5V-芯片
- 7.5V-5V-上拉
- 列
- 7.5V-3V-单片机
- (in symbol CT) +

## Library data of the parts
C1 C2 C5 C7-C11 C13 C16 C17 C20 C23 C26 C29 C30 = Cap Semi: Capacitor (Semiconductor SIM Model); Value: 104; Published: 8-Jun-2000; LatestRevisionDate: 29-May-2009; LatestRevisionNote: IPC-7351 Footprint Added.; PackageReference: C1206; Publisher: Altium Limited; PackageDescription: Chip Capacitor
C3 C4 = Cap Semi: Capacitor (Semiconductor SIM Model); Published: 8-Jun-2000; LatestRevisionDate: 29-May-2009; LatestRevisionNote: IPC-7351 Footprint Added.; PackageReference: C1206; Publisher: Altium Limited; PackageDescription: Chip Capacitor
C6 = Cap Semi: Capacitor (Semiconductor SIM Model); Value: 10uF; Published: 8-Jun-2000; LatestRevisionDate: 29-May-2009; LatestRevisionNote: IPC-7351 Footprint Added.; PackageReference: C1206; Publisher: Altium Limited; PackageDescription: Chip Capacitor
C12 C15 C18 C19 C21 C22 C24 C25 C27 C28 C31-C41 = C: 贴片电容; BOM名称: 无极性贴片电容; 淘宝ID: 封装库来自淘宝 ID：黄晶宝石; 联系售后，技术支持: https://shop463601444.taobao.com; 唯一出售店铺网址: https://shop463601444.taobao.com
C14 = Cap Semi: Capacitor (Semiconductor SIM Model); Value: 100pF; Published: 8-Jun-2000; LatestRevisionDate: 29-May-2009; LatestRevisionNote: IPC-7351 Footprint Added.; PackageReference: C1206; Publisher: Altium Limited; PackageDescription: Chip Capacitor
CON1 = P-DC: 低压电源接口; BOM名称: DC电源接口; 版权归属: 源创客; 学习资源: www.ooocke.com
D1 = SS54: 肖特基二极管; 版权归属: 源创客; 属性: 40V/3A; BOM名称: 肖特基二极管; 学习资源: www.ooocke.com
D2-D13 = 1N5819: 肖特基二极管; 淘宝ID: 封装库来自淘宝 ID：黄晶宝石; 属性: 40V/2A; BOM名称: 肖特基二极管; 欢迎光临: https://shop463601444.taobao.com
E1-E9 = CT: 贴片钽电容; 淘宝ID: 封装库来自淘宝 ID：黄晶宝石; BOM名称: 贴片钽电容; 联系售后: https://shop463601444.taobao.com
F1 = FU: 贴片保险丝; 版权归属: 封装库来自淘宝卖家 ID：黄晶宝石; BOM名称: 贴片保险丝; 学习资源: https://shop463601444.taobao.com
IC1-IC4 = 74HC154: 4线转16线译码器; 版权归属: 源创客; BOM名称: 4线转16线译码器; 学习资源: www.ooocke.com
JP1 = Header  6X2: 6*2P接插件; 版权归属: 封装库来自淘宝 ID：黄晶宝石; BOM名称: 6*2P接插件; 学习资源: https://shop463601444.taobao.com
JP3 = Header 4: 4P接插件; 版权归属: 封装库来自淘宝 ID：黄晶宝石; BOM名称: 4P接插件; 学习资源: https://shop463601444.taobao.com
JP4 JP5 = FPC-22P: FPC连接器; 版权归属: 源创客; BOM名称: FPC连接器; 学习资源: www.ooocke.com
JP6 JP7 = FPC-26P: FPC连接器; 版权归属: 源创客; BOM名称: FPC连接器; 学习资源: www.ooocke.com
LED3 LED4 LED6 LED8-LED10 = LED-SMD: 贴片LED; 版权归属: 封装库来自淘宝 ID：黄晶宝石; BOM名称: 贴片LED; 学习资源: https://shop463601444.taobao.com
R1 R3 R5 R8 R10 R11 R13 R17 R20-R22 R24-R29 R32 R34 R35 R38 R40-R44 R46-R62 = R: 贴片电阻; 版权归属: 来自淘宝 ID：黄晶宝石; 封装库来自淘宝卖家 ID：黄晶宝石: 其他店铺购入均为盗版，不享受售后技术支持服务，请立即申请退款; BOM名称: 贴片电阻; 联系售后: https://shop463601444.taobao.com
R2 = Res2: Resistor; Value: 1M; Published: 8-Jun-2000; LatestRevisionDate: 17-Jul-2002; LatestRevisionNote: Re-released for DXP Platform.; PackageReference: AXIAL-0.4; Publisher: Altium Limited; PackageDescription: Axial Device, Thru-Hole; 2 Leads; 0.4 in Pin Spacing
R4 = Res2: Resistor; Value: 10R; Published: 8-Jun-2000; LatestRevisionDate: 17-Jul-2002; LatestRevisionNote: Re-released for DXP Platform.; PackageReference: AXIAL-0.4; Publisher: Altium Limited; PackageDescription: Axial Device, Thru-Hole; 2 Leads; 0.4 in Pin Spacing
R6 R7 R9 R16 R23 R30 R31 R33 R36 R37 R39 R45 = R-8P4R: 贴片排阻; BOM名称: 贴片网络排阻; 版权归属: 封装库来自淘宝 ID：黄晶宝石; 联系售后: https://shop463601444.taobao.com
R12 = Res2: Resistor; Published: 8-Jun-2000; LatestRevisionDate: 17-Jul-2002; LatestRevisionNote: Re-released for DXP Platform.; PackageReference: AXIAL-0.4; Publisher: Altium Limited; PackageDescription: Axial Device, Thru-Hole; 2 Leads; 0.4 in Pin Spacing
R14 R15 R18 R19 = R
SP1-SP6 = 铜柱小焊盘: 铜柱; 版权归属: 封装库来自淘宝 ID：黄晶宝石; 封装库来自淘宝卖家 ID：黄晶宝石: 其他店铺购入均为盗版，不享受售后技术支持服务，请立即申请退款; BOM名称: 铜柱; 技术支持，联系售后: https://shop463601444.taobao.com
SW1 = TSW 3x6: 3x6轻触开关; 版权归属: 封装库来自淘宝 ID：黄晶宝石; BOM名称: 3x6轻触开关; 学习资源: https://shop463601444.taobao.com
U2 = STM32F103RCT6: STM32F103器件采用Cortex-M3内核，CPU最高速度达72 MHz。该产品系列具有16KB ~ 1MB Flash、多种控制外设、USB全速接口和CAN。
U12 U23 U24 = OPA4377: 4路运放
V1-V3 = AMS1117: 三端稳压芯片; BOM名称: 稳压芯片; 淘宝ID: 封装库来自淘宝 ID：黄晶宝石; 欢迎光临淘宝店铺: https://shop463601444.taobao.com
X1 = XTAL-2P: 2脚无源脚晶振; 版权归属: 封装库来自淘宝卖家 ID：黄晶宝石; BOM名称: 2脚无源脚晶振; 学习资源: https://shop463601444.taobao.com